# Altium schematic sheet Potencia.SchDoc: PLACA POTÊNCIA REVISÃO C
size A3; DocumentNumber: GA0049; SheetNumber: 3; SheetTotal: 4
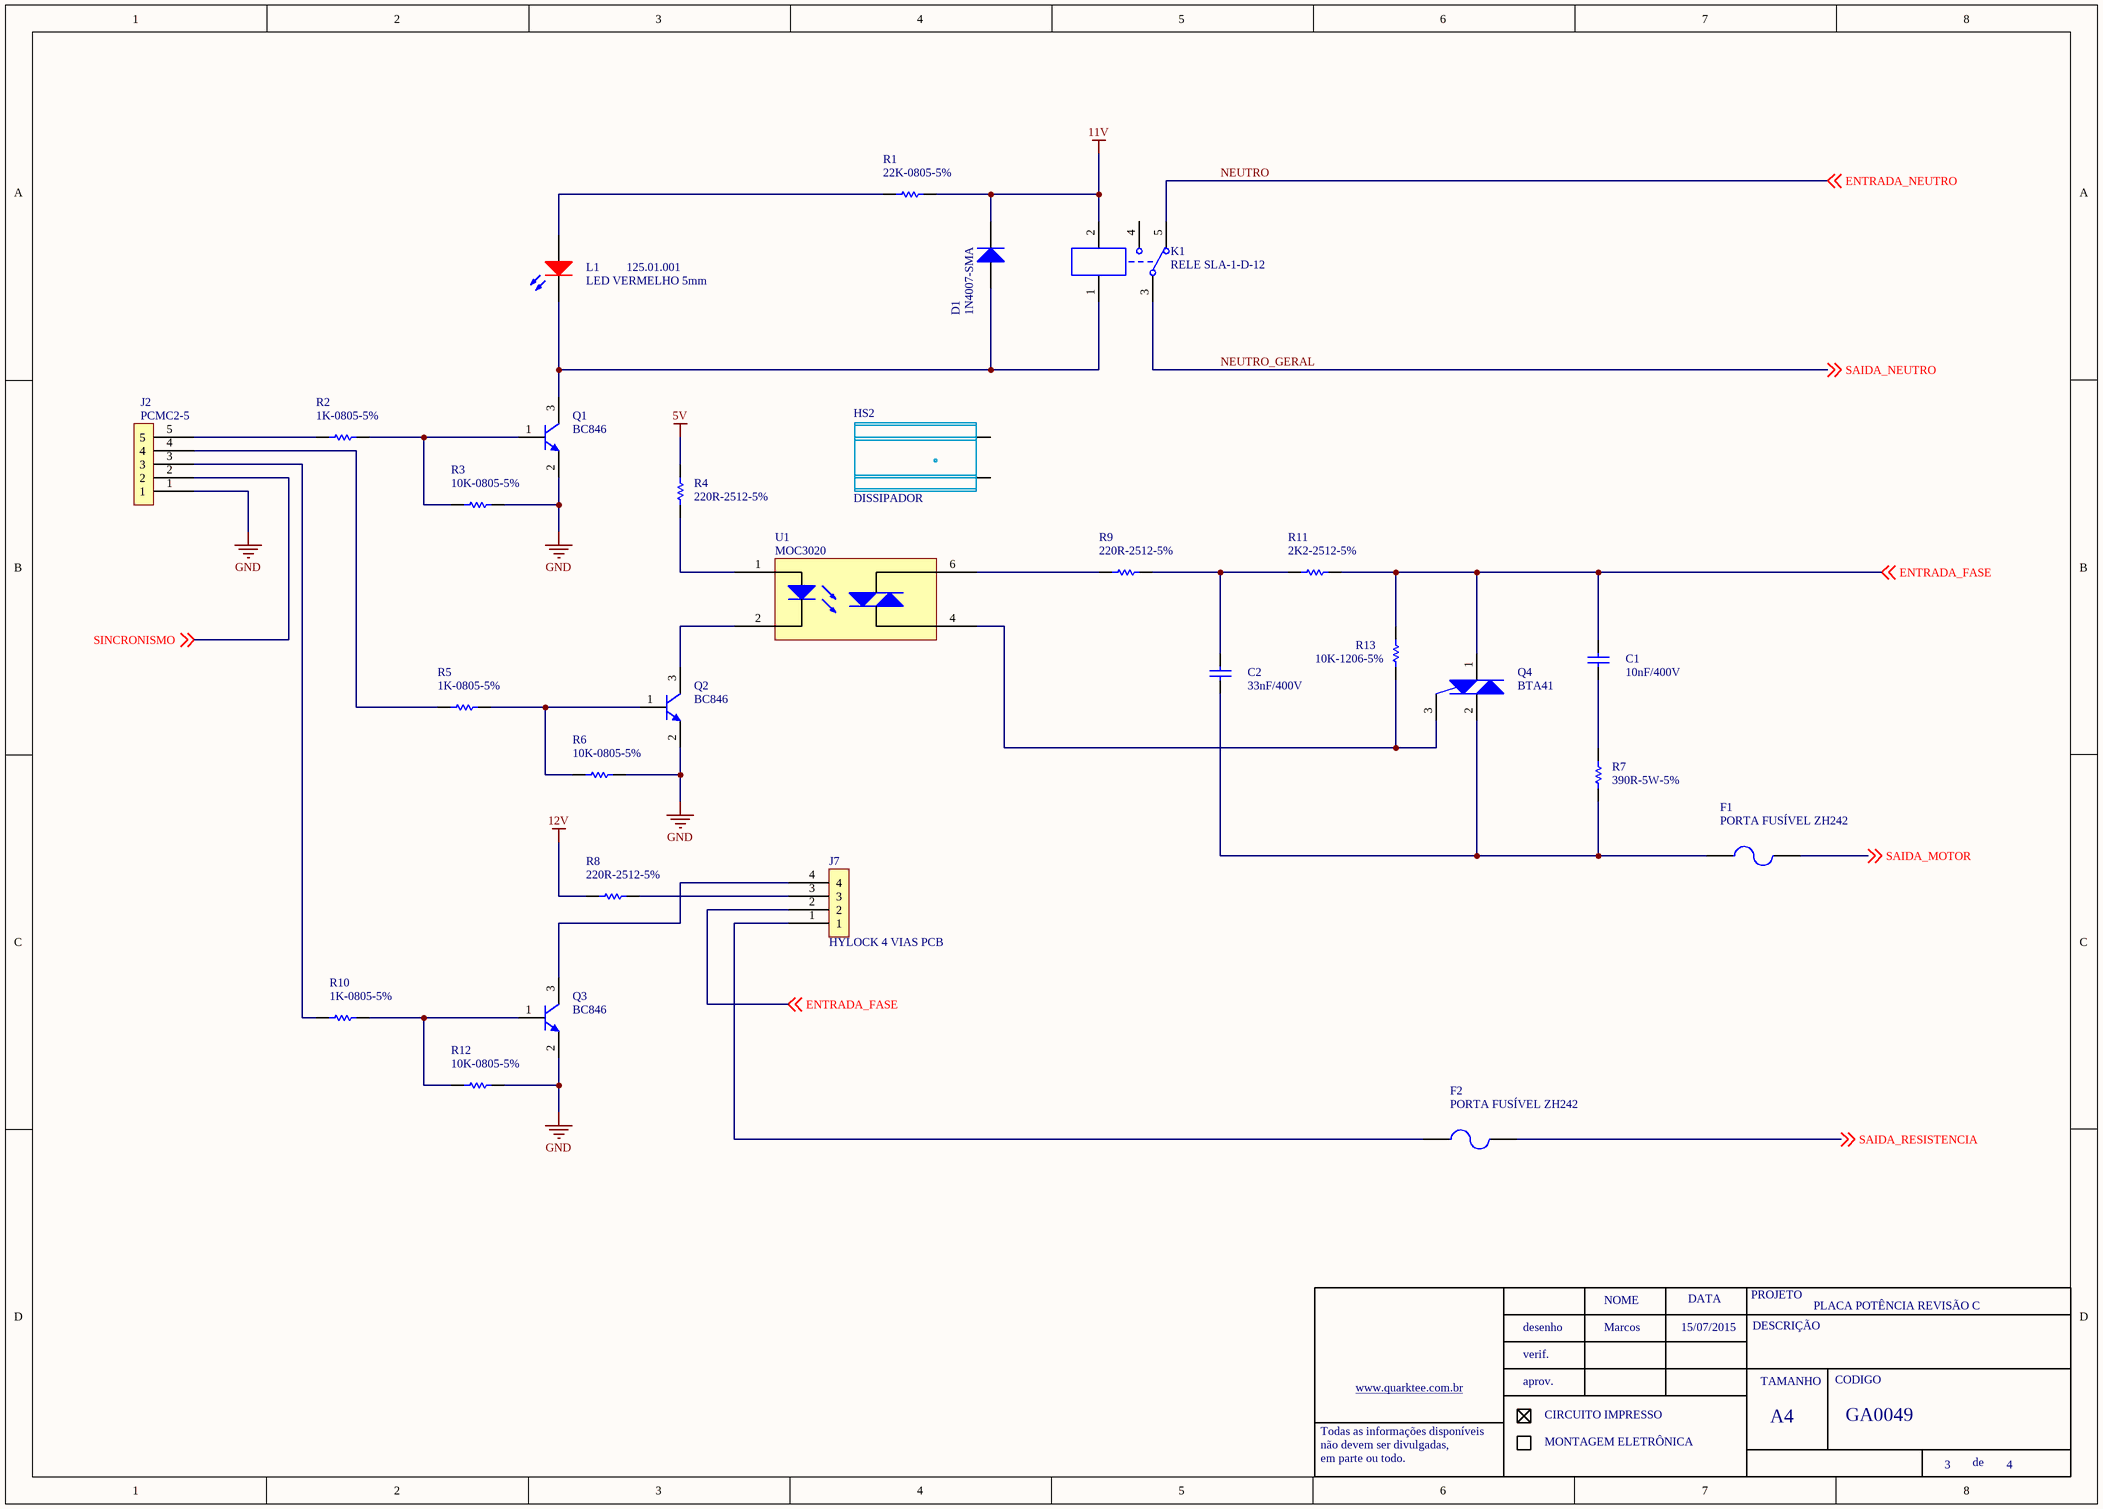
[diagram p0: Potencia.SchDoc]

## Parts
C1  10nF/400V  [cap 330nF/250V]
C2  33nF/400V  [cap 330nF/250V]
D1  1N4007-SMA  [SMA DIODES]
F1  PORTA FUSÍVEL ZH242  [ZH242_REVISADO]
F2  PORTA FUSÍVEL ZH242  [ZH242_REVISADO]
HS2  DISSIPADOR
J2  PCMC2-5  [PCMC2-5]
J7  HYLOCK 4 VIAS PCB  [CONECTOR HYLOK 4 VIAS]
K1  RELE SLA-1-D-12  [rele gigante]
L1  LED VERMELHO 5mm  ERP: 125.01.001  [LED 1206]
Q1  BC846  [SOT23 - REVISADO ONDA]
Q2  BC846  [SOT23 - REVISADO ONDA]
Q3  BC846  [SOT23 - REVISADO ONDA]
Q4  BTA41  [TO-247 - duplicate]
R1  22K-0805-5%  [0805-REVISADO ONDA]
R2  1K-0805-5%  [0805-REVISADO ONDA]
R3  10K-0805-5%  [0805-REVISADO ONDA]
R4  220R-2512-5%  [2512 - REVISADO ONDA]
R5  1K-0805-5%  [0805-REVISADO ONDA]
R6  10K-0805-5%  [0805-REVISADO ONDA]
R7  390R-5W-5%  [RESISTOR 5W FIO]
R8  220R-2512-5%  [2512 - REVISADO ONDA]
R9  220R-2512-5%  [2512 - REVISADO ONDA]
R10  1K-0805-5%  [0805-REVISADO ONDA]
R11  2K2-2512-5%  [2512 - REVISADO ONDA]
R12  10K-0805-5%  [0805-REVISADO ONDA]
R13  10K-1206-5%  [1206-REVISADO ONDA]
U1  MOC3020  [dip6]

## Nets
5V: R4.1
11V: D1.2(K) K1.2 R1.1
12V: R8.2
GND: J2.1 Q1.2(E) Q2.2(E) Q3.2(E) R3.2 R6.2 R12.2
ENTRADA_FASE: C1.2 J7.2 Q4.1(MT1) R11.2 R13.2 ; off-sheet ENTRADA_FASE
NEUTRO: K1.5 ; off-sheet ENTRADA_NEUTRO  [also labelled ENTRADA_NEUTRO]
NEUTRO_GERAL: K1.3 ; off-sheet SAIDA_NEUTRO  [also labelled SAIDA_NEUTRO]
SAIDA_MOTOR: F1.1 ; off-sheet SAIDA_MOTOR
SAIDA_RESISTENCIA: F2.1 ; off-sheet SAIDA_RESISTENCIA
SINCRONISMO: J2.2 ; off-sheet SINCRONISMO
NetC1_1: C1.1 R7.1
NetC2_1: C2.1 F1.2 Q4.2(MT2) R7.2
NetC2_2: C2.2 R9.2 R11.1
NetD1_1: D1.1(A) K1.1 L1.2(K) Q1.3(C)
NetF2_2: F2.2 J7.1
NetJ2_3: J2.3 R10.1
NetJ2_4: J2.4 R5.1
NetJ2_5: J2.5 R2.1
NetJ7_3: J7.3 R8.1
NetJ7_4: J7.4 Q3.3(C)
NetL1_1: L1.1(A) R1.2
NetQ1_1: Q1.1(B) R2.2 R3.1
NetQ2_1: Q2.1(B) R5.2 R6.1
NetQ2_3: Q2.3(C) U1.2
NetQ3_1: Q3.1(B) R10.2 R12.1
NetQ4_3: Q4.3(GATE) R13.1 U1.4
NetR4_2: R4.2 U1.1
NetR9_1: R9.1 U1.6

Not connected (* = marked no-connect by the designer): HS2 0 1; K1 4

## Notes on the sheet
- Marcos
- 15/07/2015
- NOME
- DATA
- PROJETO
- DESCRIÇÃO
- www.quarktee.com.br
- desenho
- verif.
- aprov.
- TAMANHO
- CODIGO
- Todas as informações disponíveis
- não devem ser divulgadas,
- em parte ou todo.
- CIRCUITO IMPRESSO
- MONTAGEM ELETRÔNICA
- A4
- de

## Library data of the parts
C1 C2 = 100nF/50-0805-NPO: ERP: 104.11.005
D1 = 1N4007: ERP: 120.18.001
F1 F2 = PORTA FUSÍVEL TIPO BERÇO: ERP: 426.00.002
HS2 = DISSIPADOR 40mm PÉ
J7 = PCMC2-4
K1 = AT1RC2: ERP: 203.00.005
Q1-Q3 = BC846: BC846L; ERP: 106.22.001
Q4 = BT134-TO220: BT134
R1 R11 R13 = 220R-2512-5%: ERP: 102.31.000
R2 R5 R10 = 10K-0805-5%: ERP: 102.11.054
R7 = 47R-5W-5%: ERP: 103.16.005
R3 R6 R12 = 10K-0805-5%: ERP: 102.11.054
R4 R8 R9 = 220R-2512-5%: ERP: 102.31.000